# Altium schematic sheet Sheet1.SchDoc
size 420 x 297 mm; SheetNumber: 1; SheetTotal: 2
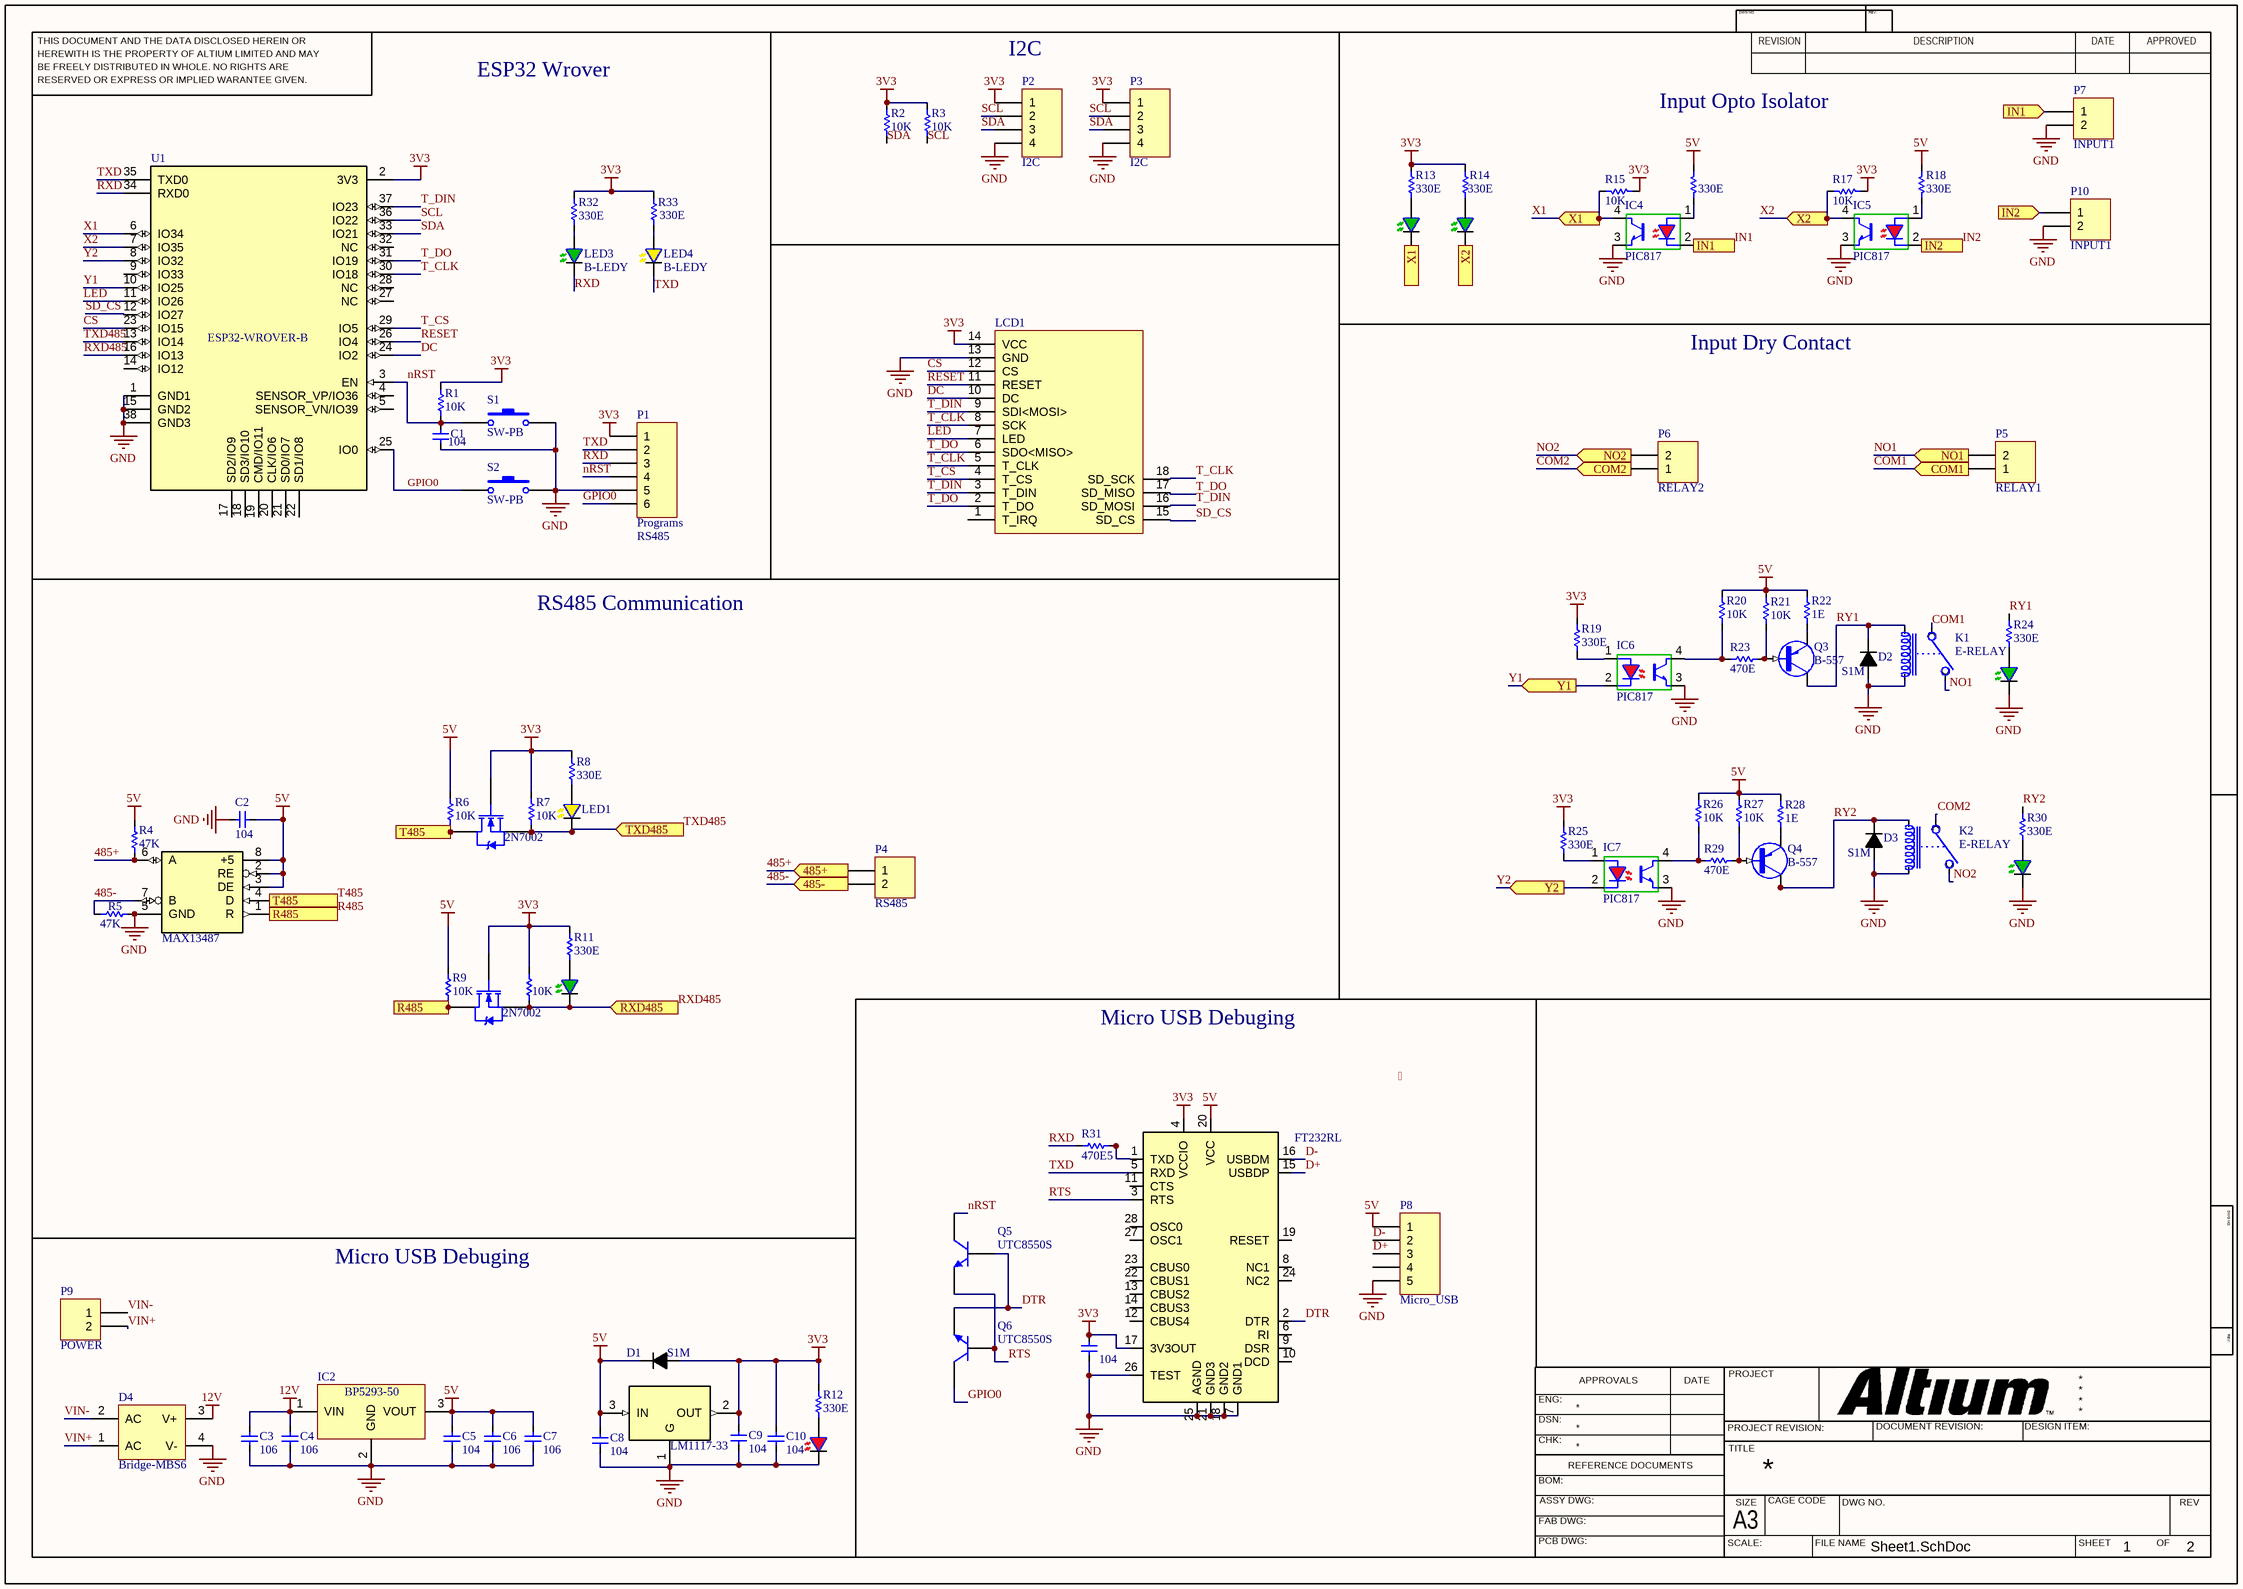
[diagram p0: Sheet1.SchDoc]

## Parts
C1  104  [C0805]
C2  104  [C0805]
C3  106  [C0805]
C4  106  [C0805]
C5  104  [C0805]
C6  106  [C0805]
C7  106  [C0805]
C8  104  [C0805]
C9  104  [C0805]
C10  104  [C0805]
C11  104  [C0805]
D1  S1M  [DO-214AC]
D2  S1M  [DO-214AC]
D3  S1M  [DO-214AC]
D4  Bridge-MBS6  [DF1504S]
IC1  MAX13487  [SO8]
IC2  BP5293-33  [BP5293-50 RIGHT]  (value not drawn)
IC3  LM1117-33  [SOT223_L]
IC4  PIC817  [PC817-SMT]
IC5  PIC817  [PC817-SMT]
IC6  PIC817  [PC817-SMT]
IC7  PIC817  [PC817-SMT]
IC8  FT232RL  [SSOP-28]
K1  E-RELAY  [RELAY_NY-5W-K-IE]
K2  E-RELAY  [RELAY_NY-5W-K-IE]
L1  L1  [0805_LED - RED]  (value not drawn)
LCD1  (no value)  [LCD 2.4 TFT SPI 240x320]
LED1  LED1  [0805_LED - YELLOW]  (value not drawn)
LED2  LED2  [0805_LED - GREEN]  (value not drawn)
LED3  B-LEDY  [0805_LED - GREEN]
LED4  B-LEDY  [0805_LED - YELLOW]
LED5  LED5  [0805_LED - GREEN]  (value not drawn)
LED6  LED6  [0805_LED - GREEN]  (value not drawn)
LED7  LED7  [0805_LED - GREEN]  (value not drawn)
LED8  LED8  [0805_LED - GREEN]  (value not drawn)
P1  Programs  [HDR1X6]
P2  I2C  [100104ST/RH]
P3  I2C  [100104ST/RH]
P4  RS485  [ECH350R-02P]
P5  RELAY1  [ECH350R-02P]
P6  RELAY2  [ECH350R-02P]
P7  INPUT1  [ECH350R-02P]
P8  Micro_USB  [USB-mico-S]
P9  POWER  [ECH350R-02P]
P10  INPUT1  [ECH350R-02P]
Q1  2N7002  [SOT-23_N]
Q2  2N7002  [SOT-23_N]
Q3  B-557  [SOT23_M-edit]
Q4  B-557  [SOT23_M-edit]
Q5  UTC8550S  [SOT23_M-edit]
Q6  UTC8550S  [SOT23_M-edit]
R1  10K  [6-0805_L]
R2  10K  [6-0805_L]
R3  10K  [6-0805_L]
R4  47K  [6-0805_L]
R5  47K  [6-0805_L]
R6  10K  [6-0805_L]
R7  10K  [6-0805_L]
R8  330E  [6-0805_L]
R9  10K  [6-0805_L]
R10  10K  [6-0805_L]
R11  330E  [6-0805_L]
R12  330E  [6-0805_L]
R13  330E  [6-0805_L]
R14  330E  [6-0805_L]
R15  10K  [6-0805_L]
R16  330E  [6-0805_L]
R17  10K  [6-0805_L]
R18  330E  [6-0805_L]
R19  330E  [6-0805_L]
R20  10K  [6-0805_L]
R21  10K  [6-0805_L]
R22  1E  [6-0805_L]
R23  470E  [6-0805_L]
R24  330E  [6-0805_L]
R25  330E  [6-0805_L]
R26  10K  [6-0805_L]
R27  10K  [6-0805_L]
R28  1E  [6-0805_L]
R29  470E  [6-0805_L]
R30  330E  [6-0805_L]
R31  470E5  [6-0805_L]
R32  330E  [6-0805_L]
R33  330E  [6-0805_L]
S1  SW-PB  [Push SW]
S2  SW-PB  [Push SW]
U1  ESP32-WROVER-B  [ESP32 - WROVER-B]

## Ports
485+ (in), 485- (in), COM1 (in), COM2 (in), IN1 (in), IN2 (in), NO1 (in), NO2 (in), R485 (in), RXD485 (in), T485 (in), TXD485 (in), X1 (in), X2 (in), Y1 (in), Y2 (in)

## Nets
3V3: C9.1 C10.1 C11.2 D1.A IC3.2(OUT) IC8.4(VCCIO) IC8.17(3V3OUT) LCD1.14(VCC) P1.1 P2.1 P3.1 Q1.1(G) Q2.1(G) R1.2 R2.2 R3.2 R7.2 R8.2 R10.2 R11.2 R12.2 R13.2 R14.2 R15.1 R17.1 R19.1 R25.1 R32.2 R33.2 U1.2(3V3)
5V: C2.2 C5.1 C6.1 C7.1 C8.1 D1.K IC1.2(RE) IC1.3(DE) IC1.8(+5) IC2.3(VOUT) IC3.3(IN) IC8.20(VCC) P8.1 R4.1 R6.2 R9.2 R16.1 R18.1 R20.1 R21.1 R22.1 R26.1 R27.1 R28.1
12V: C3.1 C4.1 D4.3(V+) IC2.1(VIN)
GND: C1.1 C2.1 C3.2 C4.2 C5.2 C6.2 C7.2 C8.2 C9.2 C10.2 C11.1 D2.A D3.A D4.4(V-) IC1.5(GND) IC2.2(GND) IC3.1(G) IC4.3 IC5.3 IC6.3 IC7.3 IC8.7(GND1) IC8.18(GND2) IC8.21(GND3) IC8.25(AGND) IC8.26(TEST) K1.4(COIL_B) K2.4(COIL_B) L1.K LCD1.13(GND) LED7.K LED8.K P1.5 P2.4 P3.4 P7.2 P8.5 P10.2 R5.2 S1.2 S2.2 U1.1(GND1) U1.15(GND2) U1.38(GND3)
485+: IC1.6(A) P4.1 R4.2 ; port 485+
485-: IC1.7(B) P4.2 R5.1 ; port 485-
COM1: K1.1(COM) P5.1 ; port COM1
COM2: K2.1(COM) P6.1 ; port COM2
CS: LCD1.12(CS) U1.23(IO15)
D+: IC8.15(USBDP) P8.3
D-: IC8.16(USBDM) P8.2
DC: LCD1.10(DC) U1.24(IO2)
DTR: IC8.2(DTR) Q5.B Q6.E
GPIO0: P1.6 Q6.C S2.1 U1.25(IO0)
IN1: IC4.2 P7.1 ; port IN1
IN2: IC5.2 P10.1 ; port IN2
LED: LCD1.7(LED) U1.11(IO26)
NO1: K1.2(No) P5.2 ; port NO1
NO2: K2.2(No) P6.2 ; port NO2
nRST: C1.2 P1.4 Q5.C R1.1 S1.1 U1.3(EN)
R485: IC1.1(R) Q2.3(D) R9.1 ; port R485
RESET: LCD1.11(RESET) U1.26(IO4)
RTS: IC8.3(RTS) Q5.E Q6.B
RXD: LED3.K P1.3 R31.1 U1.34(RXD0)
RXD485: LED2.K Q2.2(S) R10.1 U1.16(IO13) ; port RXD485
RY1: D2.K K1.3(COIL_A) Q3.C R24.2
RY2: D3.K K2.3(COIL_A) Q4.C R30.2
SCL: P2.2 P3.2 R3.1 U1.36(IO22)
SD_CS: LCD1.15(SD_CS) U1.12(IO27)
SDA: P2.3 P3.3 R2.1 U1.33(IO21)
T485: IC1.4(D) Q1.3(D) R6.1 ; port T485
T_CLK: LCD1.5(T_CLK) LCD1.8(SCK) LCD1.18(SD_SCK) U1.30(IO18)
T_CS: LCD1.4(T_CS) U1.29(IO5)
T_DIN: LCD1.3(T_DIN) LCD1.9(SDI<MOSI>) LCD1.16(SD_MOSI) U1.37(IO23)
T_DO: LCD1.2(T_DO) LCD1.6(SDO<MISO>) LCD1.17(SD_MISO) U1.31(IO19)
TXD: IC8.5(RXD) LED4.K P1.2 U1.35(TXD0)
TXD485: LED1.K Q1.2(S) R7.1 U1.13(IO14) ; port TXD485
VIN+: D4.1(AC) P9.2
VIN-: D4.2(AC) P9.1
X1: IC4.4 LED5.K R15.2 U1.6(IO34) ; port X1
X2: IC5.4 LED6.K R17.2 U1.7(IO35) ; port X2
Y1: IC6.2 U1.10(IO25) ; port Y1
Y2: IC7.2 U1.8(IO32) ; port Y2
NetIC4_1: IC4.1 R16.2
NetIC5_1: IC5.1 R18.2
NetIC6_1: IC6.1 R19.2
NetIC6_4: IC6.4 R20.2 R23.1
NetIC7_1: IC7.1 R25.2
NetIC7_4: IC7.4 R26.2 R29.1
NetIC8_1: IC8.1(TXD) R31.2
NetL1_A: L1.A R12.1
NetLED1_A: LED1.A R8.1
NetLED2_A: LED2.A R11.1
NetLED3_A: LED3.A R32.1
NetLED4_A: LED4.A R33.1
NetLED5_A: LED5.A R13.1
NetLED6_A: LED6.A R14.1
NetLED7_A: LED7.A R24.1
NetLED8_A: LED8.A R30.1
NetQ3_B: Q3.B R21.2 R23.2
NetQ3_E: Q3.E R22.2
NetQ4_B: Q4.B R27.2 R29.2
NetQ4_E: Q4.E R28.2

Not connected (* = marked no-connect by the designer): IC8 6(RI) 8(NC1) 9(DSR) 10(DCD) 11(CTS) 12(CBUS4) 13(CBUS2) 14(CBUS3) 19(RESET) 22(CBUS1) 23(CBUS0) 24(NC2) 27(OSC1) 28(OSC0); LCD1 1(T_IRQ); P8 4; U1 4(SENSOR_VP/IO36) 5(SENSOR_VN/IO39) 9(IO33) 14(IO12) 17(SD2/IO9) 18(SD3/IO10) 19(CMD/IO11) 20(CLK/IO6) 21(SD0/IO7) 22(SD1/IO8) 27(NC) 28(NC) 32(NC)

## Notes on the sheet
- (near P2) I2C
- ESP32 Wrover
- Input Opto Isolator
- Input Dry Contact
- (near P1) RS485
- RS485 Communication
- Micro USB Debuging
- 
- THIS DOCUMENT AND THE DATA DISCLOSED HEREIN OR
- HEREWITH IS THE PROPERTY OF ALTIUM LIMITED AND MAY
- DWG NO:
- REVISION
- REV:
- DESCRIPTION
- DATE
- APPROVED
- BE FREELY DISTRIBUTED IN WHOLE. NO RIGHTS ARE
- RESERVED OR EXPRESS OR IMPLIED WARANTEE GIVEN.
- ENG:
- APPROVALS
- PROJECT
- DSN:
- CHK:
- REFERENCE DOCUMENTS
- PROJECT REVISION:
- TITLE
- DOCUMENT REVISION:
- DESIGN ITEM:
- BOM:
- FAB DWG:
- PCB DWG:
- ASSY DWG:
- SCALE:
- A3
- SIZE
- CAGE CODE
- FILE NAME
- DWG NO.
- SHEET
- OF
- REV

## Library data of the parts
C1-C11 = C-C10P
D1-D3 = B-1N4148: Siligon Diode,Soccky Diode
D4 = Bridge-MAB: Diode Bridge; Published: 24-Mar-1999; LatestRevisionDate: 17-Jul-2002; LatestRevisionNote: Re-released for DXP Platform.; PackageReference: D-46_6A; Publisher: Altium Limited; PackageDescription: Bridge Rectifier; 4 Terminals; Body 16.8 x 16.8 mm (typ); Pitch 10.67 mm
IC1 = A-MAX3082: Convertor RS-485 Driver
IC2 = BP5293-50
IC3 = A-LM1117
IC4-IC7 = A-PIC817
K1 K2 = E-RELAY3
L1 = B-LEDR1: ซุปเปอร์ไบท์ สีแดง
LCD1 = LCD 2.4 TFT SPI 240X320
LED1 = B-LEDY
LED2 LED3 LED5-LED8 = B-LEDG
P1 = Header 6: Header, 6-Pin; LatestRevisionDate: 17-Jul-2002; LatestRevisionNote: Re-released for DXP Platform.; Publisher: Altium Limited
P2 P3 = Header 4: Header, 4-Pin; LatestRevisionDate: 17-Jul-2002; LatestRevisionNote: Re-released for DXP Platform.; Publisher: Altium Limited
P4-P7 P9 P10 = Header 2: Header, 2-Pin; LatestRevisionDate: 17-Jul-2002; LatestRevisionNote: Re-released for DXP Platform.; Publisher: Altium Limited
P8 = MHDR1X5: Header, 5-Pin; LatestRevisionDate: 17-Jul-2002; LatestRevisionNote: Re-released for DXP Platform.; Publisher: Altium Limited
Q1 Q2 = NMOS-2: N-Channel Power MOSFET; Note: Pin 2 is electrically connected to pin 4.; Published: 8-Jun-2000; LatestRevisionDate: 17-Jul-2002; LatestRevisionNote: Re-released for DXP Platform.; DatasheetVersion: PD-9.814; PackageVersion: Feb-1997; PackageReference: TO-220AB; Publisher: Altium Limited; PackageDescription: TO, Thru-Hole, Vertical, Heatsink Mounted; 3 In-Line Leads; Pitch 2.54 mm; ComponentLink1Description: Manufacturer Link; ComponentLink1URL: http://www.irf.com/
Q3 Q4 = B-557: Transistor PNP
Q5 Q6 = NPN: NPN Bipolar Transistor; Published: 8-Jun-2000; LatestRevisionDate: 17-Jul-2002; LatestRevisionNote: Re-released for DXP Platform.; PackageReference: TO-226-AA; Publisher: Altium Limited; PackageDescription: TO, Flat Index; 3 In-Line, Axial Leads; Body Dia. 4.8mm; Leads 0.55 x 0.51 mm (max); Code_JEDEC: TO-226-AA
R1-R14 R24 R30-R33 = M-R1/4WS: Resistor
R15-R23 R25-R29 = R: Resistor
S1 S2 = SW-PB: Switch; Published: 24-Mar-1999; LatestRevisionDate: 17-Jul-2002; LatestRevisionNote: Re-released for DXP Platform.; PackageReference: SPST-2; Publisher: Altium Limited; PackageDescription: Switch; 2 Leads
U1 = ESP32-WROVER-B: IOT